# EAGLE design Simple WiFi RS232 by Bruno (EAGLE 9.6.1)
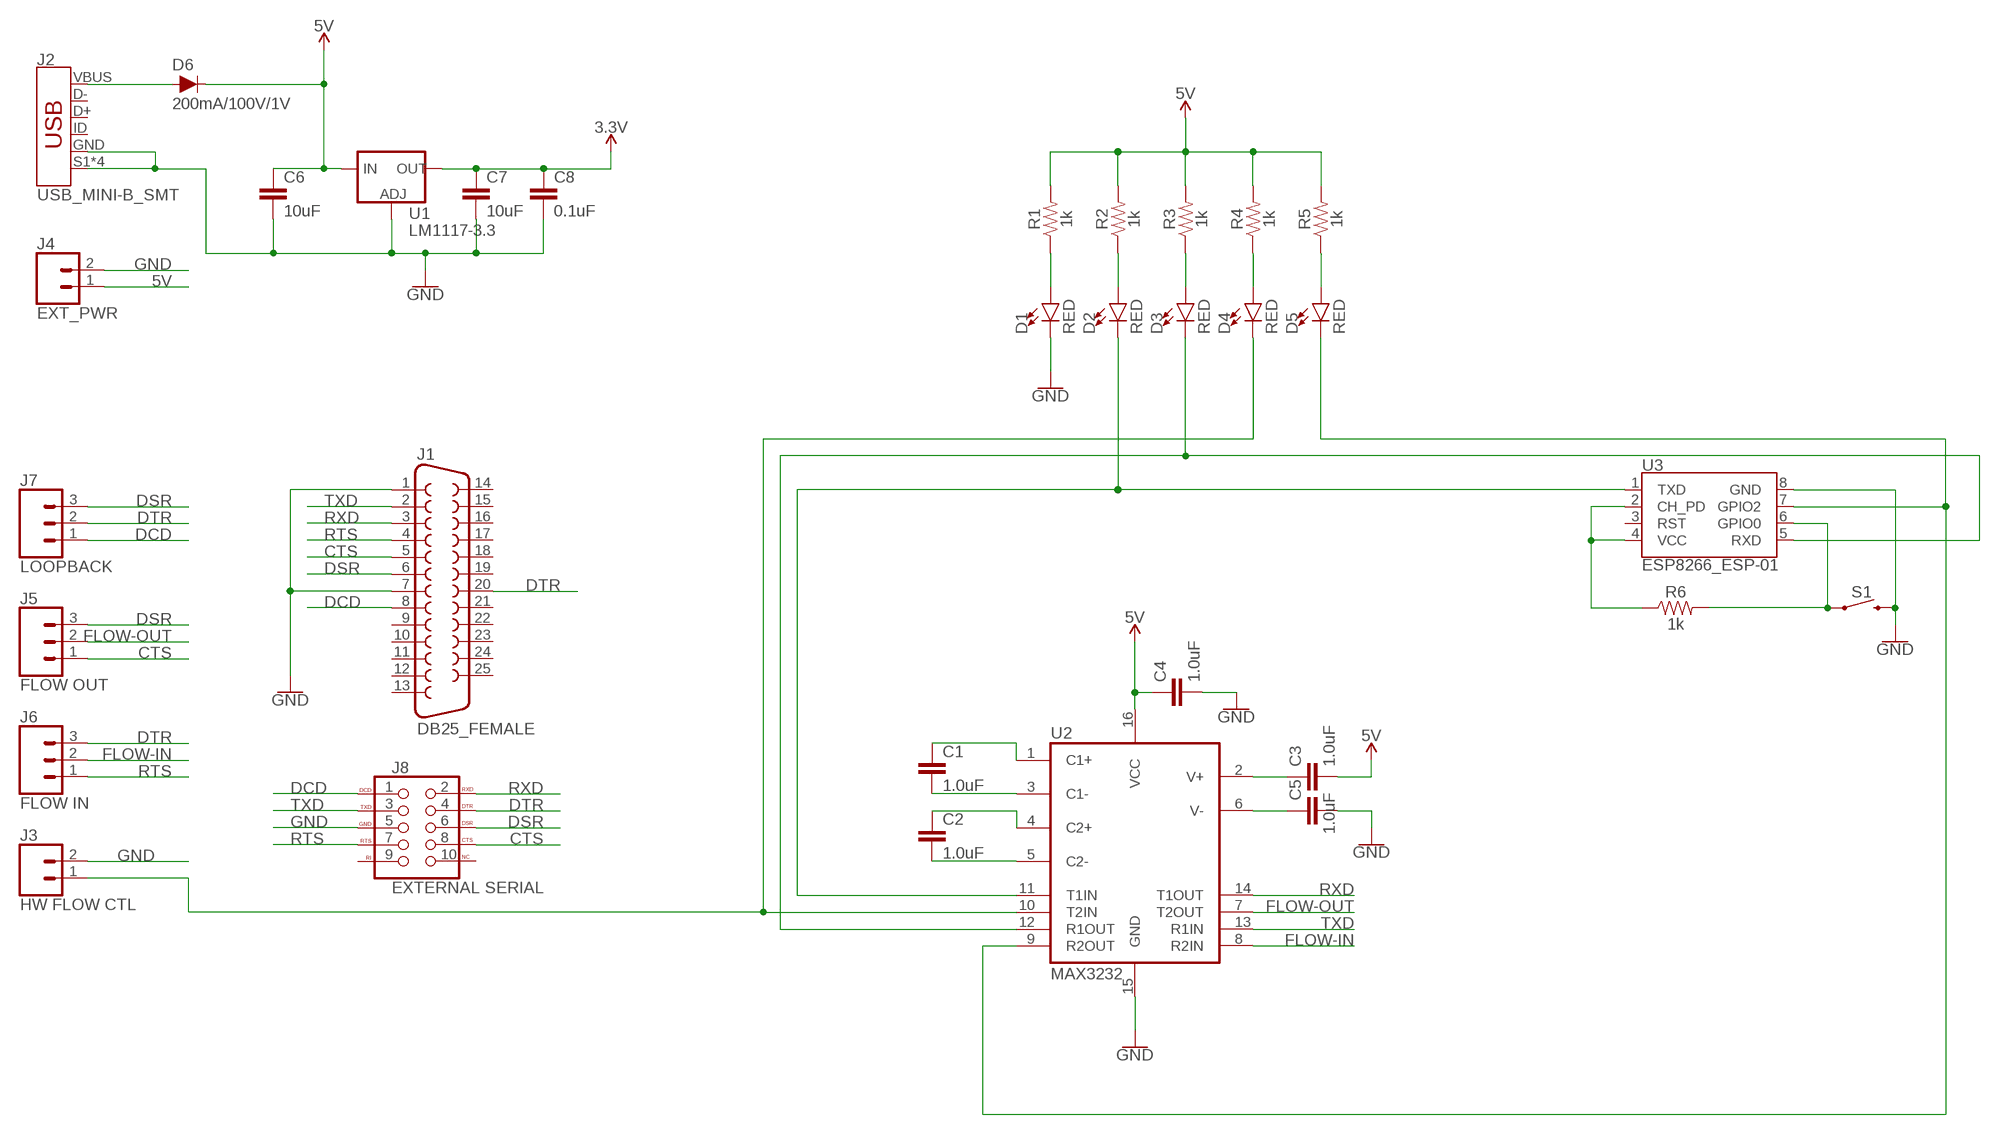
[diagram p0: schematic, sheet 1]

## Parts
C1  1.0uF  1.0UF-0603-16V-10%  [0603]
C2  1.0uF  1.0UF-0603-16V-10%  [0603]
C3  1.0uF  1.0UF-0603-16V-10%  [0603]
C4  1.0uF  1.0UF-0603-16V-10%  [0603]
C5  1.0uF  1.0UF-0603-16V-10%  [0603]
C6  10uF  10UF-0603-6.3V-20%  [0603]
C7  10uF  10UF-0603-6.3V-20%  [0603]
C8  0.1uF  0.1UF-0603-25V-(+80/-20%)  [0603]
D1  RED  LED-RED0603  [LED-0603]
D2  RED  LED-RED0603  [LED-0603]
D3  RED  LED-RED0603  [LED-0603]
D4  RED  LED-RED0603  [LED-0603]
D5  RED  LED-RED0603  [LED-0603]
D6  200mA/100V/1V  DIODE-1N4148  [DIODE-1N4148]
J1  DB25_FEMALE  DB25_FEMALEHP  [F25HP]
J2  USB_MINI-B_SMT  [USB-MINIB]
J3  HW FLOW CTL  CONN_02  [1X02]
J4  EXT_PWR  CONN_02  [1X02]
J5  FLOW OUT  CONN_03  [1X03]
J6  FLOW IN  CONN_03  [1X03]
J7  LOOPBACK  CONN_03  [1X03]
J8  EXTERNAL SERIAL  10PIN_SERIALPTH2  [2X5-SHROUDED]
R1  1k  1KOHM-0603-1/10W-1%  [0603]
R2  1k  1KOHM-0603-1/10W-1%  [0603]
R3  1k  1KOHM-0603-1/10W-1%  [0603]
R4  1k  1KOHM-0603-1/10W-1%  [0603]
R5  1k  1KOHM-0603-1/10W-1%  [0603]
R6  1k  1KOHM-0603-1/10W-1%  [0603]
S1  MOMENTARY-SWITCH-SPST-PTH-6.0MM  [TACTILE_SWITCH_PTH_6.0MM]
U1  LM1117-3.3  V_REG_LM1117SOT223  [SOT223]
U2  MAX3232  MAX2323PTH  [DIP16]
U3  ESP8266_ESP-01  [ESP8266_ESP-01]

## Nets
3.3V: C7.1 C8.1 U1.2(OUT) U1.4(OUT)
5V: C3.2 C4.1 C6.1 D6.C J4.1 R1.2 R2.2 R3.2 R4.2 R5.2 U1.3(IN) U2.16(VCC)
CTS: J1.5 J5.1 J8.8(CTS)
DCD: J1.8 J7.1 J8.1(DCD)
DSR: J1.6 J5.3 J7.3 J8.6(DSR)
DTR: J1.20 J6.3 J7.2 J8.4(DTR)
FLOW-IN: J6.2 U2.8(R2IN)
FLOW-OUT: J5.2 U2.7(T2OUT)
GND: C4.2 C5.2 C6.2 C7.2 C8.2 D1.C J1.1 J1.7 J2.GND J2.S1(SHIELD) J2.S2(SHIELD) J2.S3(SHIELD) J2.S4(SHIELD) J3.2 J4.2 J8.5(GND) S1.3 U1.1(ADJ) U2.15(GND) U3.8(GND)
N$1: R6.2 S1.1 U3.6(GPIO0)
N$2: C1.1 U2.1(C1+)
N$3: C1.2 U2.3(C1-)
N$4: C2.1 U2.4(C2+)
N$5: C2.2 U2.5(C2-)
N$6: C3.1 U2.2(V+)
N$7: C5.1 U2.6(V-)
N$8: D1.A R1.1
N$9: D2.A R2.1
N$10: D3.A R3.1
N$11: D4.A R4.1
N$12: D5.A R5.1
N$13: R6.1 U3.2(CH_PD) U3.4(VCC)
N$14: D6.A J2.VBUS
N$15: D4.C J3.1 U2.10(T2IN)
N$16: D2.C U2.11(T1IN) U3.1(TXD)
N$17: D3.C U2.12(R1OUT) U3.5(RXD)
N$18: D5.C U2.9(R2OUT) U3.7(GPIO2)
RTS: J1.4 J6.1 J8.7(RTS)
RXD: J1.3 J8.2(RXD) U2.14(T1OUT)
TXD: J1.2 J8.3(TXD) U2.13(R1IN)
Unconnected: J1.9 J1.10 J1.11 J1.12 J1.13 J1.14 J1.15 J1.16 J1.17 J1.18 J1.19 J1.21 J1.22 J1.23 J1.24 J1.25 J2.D+ J2.D- J2.ID J8.9(RI) U3.3(RST)

## Power pins joined to a net without a drawn wire
NC: J8.10(NC)

## Library data of the parts
C1-C5 = SparkFun-Capacitors:1.0UF: 1µF ceramic capacitors A capacitor is a passive two-terminal electrical component used to store electrical energy temporarily in an electric field.; PROD_ID: CAP-00868
C6 C7 = SparkFun-Capacitors:10UF: 10.0µF ceramic capacitors A capacitor is a passive two-terminal electrical component used to store electrical energy temporarily in an electric field.; PROD_ID: CAP-11015
C8 = SparkFun-Capacitors:0.1UF: 0.1µF ceramic capacitors A capacitor is a passive two-terminal electrical component used to store electrical energy temporarily in an electric field.; PROD_ID: CAP-00810
D1-D5 = SparkFun-LED:LED-RED: Red SMD LED Used in manufacturing of most products at SparkFun Packages: 0603 - SMD 0603 package [Product Link] <http://docs.avagotech.com/docs/AV02-0551EN> 0603 SMART - SMD 0603 SMART package ( more efficient and expensive)[Product Link] <http://www.osram-os.com/Graphics/XPic2/00077099_0.pdf> 1206 - SMD1206 package [Product Link] <https://www.sparkfun.com/datasheets/DevTools/LilyPad/Q150OVS4.pdff> SparkFun Products: Pro Mini 328 -5V <https://www.sparkfun.com/products/821> RedBoard <https://www.sparkfun.com/products/12757> IOIO-OTG <https://www.sparkfun.com/products/13613>; PROD_ID: DIO-00819
D6 = SparkFun-DiscreteSemi:DIODE: Diode These are standard reverse protection diodes and small signal diodes. SparkFun Products: SparkFun SparkPunk Sound Kit <https://www.sparkfun.com/products/11177> SparkFun ESP8266 Thing <https://www.sparkfun.com/products/13231>; PROD_ID: DIO-08378
J1 = SparkFun-Retired:DB25_FEMALE: 25 Pin male connector. PCB edge mount for regular PCB thicknesses. This connector will connect directly to the back of a PC parallel port or through a normal DB25 extension cable (M/F). SKU: PRT-08287
J2 = SparkFun-Connectors:USB_MINI-B: USB type Mini-B Connector Breaks out 5th pin, and includes shield pins if needed. SparkFun Products: SparkFun FTDI Basic Breakout <https://www.sparkfun.com/products/9716> SparkFun XBee Explorer USB <https://www.sparkfun.com/products/11812> SparkFun Redboard <https://www.sparkfun.com/products/12757>; PROD_ID: CONN-08193; SF_ID: PRT-00587
J3 J4 = SparkFun-Connectors:CONN_02: Multi connection point. Often used as Generic Header-pin footprint for 0.1 inch spaced/style header connections On any of the 0.1 inch spaced packages, you can populate with these: Break Away Headers - Straight <https://www.sparkfun.com/products/116> (PRT-00116) Break Away Male Headers - Right Angle <https://www.sparkfun.com/products/553> (PRT-00553) Female Headers <https://www.sparkfun.com/products/115> (PRT-00115) Break Away Headers - Machine Pin <https://www.sparkfun.com/products/117> (PRT-00117) Break Away Female Headers - Swiss Machine Pin <https://www.sparkfun.com/products/743> (PRT-00743) For SCREWTERMINALS and SPRING TERMINALS visit here: Screw Terimnals on SparkFun.com <https://www.sparkfun.com/search/results?term=Screw+Terminals> (5mm/3.5mm/2.54mm spacing) This device is also useful as a general connection point to wire up your design to another part of your project. Our various solder wires solder well into these plated through hole pads. Hook-Up Wire - Assortment (Stranded, 22 AWG) <https://www.sparkfun.com/products/11375> (PRT-11375) Hook-Up Wire - Assortment (Solid Core, 22 AWG) <https://www.sparkfun.com/products/11367> (PRT-11367) View the entire wire category on our website here <https://www.sparkfun.com/categories/141> Special notes: Molex polarized connector foot print use with: PRT-08233 with associated crimp pins and housings. 2.54_SCREWTERM for use with PRT-10571. 3.5mm Screw Terminal footprints for PRT-08084 5mm Screw Terminal footprints for use with PRT-08432
J5-J7 = SparkFun-Connectors:CONN_03: Multi connection point. Often used as Generic Header-pin footprint for 0.1 inch spaced/style header connections On any of the 0.1 inch spaced packages, you can populate with these: Break Away Headers - Straight <https://www.sparkfun.com/products/116> (PRT-00116) Break Away Male Headers - Right Angle <https://www.sparkfun.com/products/553> (PRT-00553) Female Headers <https://www.sparkfun.com/products/115> (PRT-00115) Break Away Headers - Machine Pin <https://www.sparkfun.com/products/117> (PRT-00117) Break Away Female Headers - Swiss Machine Pin <https://www.sparkfun.com/products/743> (PRT-00743) Stackable Header - 3 Pin (Female, 0.1") <https://www.sparkfun.com/products/13875> (PRT-13875) For SCREWTERMINALS and SPRING TERMINALS visit here: Screw Terimnals on SparkFun.com <https://www.sparkfun.com/search/results?term=Screw+Terminals> (5mm/3.5mm/2.54mm spacing) This device is also useful as a general connection point to wire up your design to another part of your project. Our various solder wires solder well into these plated through hole pads. Hook-Up Wire - Assortment (Stranded, 22 AWG) <https://www.sparkfun.com/products/11375> (PRT-11375) Hook-Up Wire - Assortment (Solid Core, 22 AWG) <https://www.sparkfun.com/products/11367> (PRT-11367) View the entire wire category on our website here <https://www.sparkfun.com/categories/141> Special notes: Molex polarized connector foot print use with SKU : PRT-08232 with associated crimp pins and housings.
J8 = myparts:10PIN_SERIAL: AVR 10-pin ICSP Header This is the standard AVR In Circuit Serial Programming header. Minimal, but includes pin one indicator. Works with standard Olimex programmers. This part has been reconfigured to the pinout for a standard 10-pin RS-232 header SparkFun Products: 2x5 AVR ICSP Male Header <https://www.sparkfun.com/products/778> - PTH 2x5 Pin Shrouded Header <https://www.sparkfun.com/products/8506> - PTH2; PROD_ID: CONN-08671; SF_ID: PRT-08506
R1-R6 = SparkFun-Resistors:1KOHM: 1kΩ resistor A resistor is a passive two-terminal electrical component that implements electrical resistance as a circuit element. Resistors act to reduce current flow, and, at the same time, act to lower voltage levels within circuits. - Wikipedia; PROD_ID: RES-07856
S1 = SparkFun-Switches:MOMENTARY-SWITCH-SPST: Momentary Switch (Pushbutton) - SPST Normally-open (NO) SPST momentary switches (buttons, pushbuttons). Variants PTH-12MM - 12mm square, through-hole Momentary Pushbutton Switch - 12mm Square <https://www.sparkfun.com/products/9190> (COM-09190) PTH-6.0MM, PTH-6.0MM-KIT - 6.0mm square, through-hole Mini Pushbutton Switch <https://www.sparkfun.com/products/97> (COM-00097) KIT package intended for soldering kit's - only one side of pads' copper is exposed. PTH-RIGHT-ANGLE-KIT - Right-angle, through-hole Right Angle Tactile Button <https://www.sparkfun.com/products/10791> - Used on SparkFun BigTime Watch Kit <https://www.sparkfun.com/products/11734> SMD-12MM - 12mm square, surface-mount Tactile Button - SMD (12mm) <https://www.sparkfun.com/products/12993> (COM-12993) Used on SparkFun PicoBoard <https://www.sparkfun.com/products/11888> SMD-4.5MM - 4.5mm Square Trackball Switch Used on SparkFun Blackberry Trackballer Breakout <https://www.sparkfun.com/products/13169> SMD-4.6MMX2.8MM - 4.60mm x 2.80mm, surface mount Used on SparkFun SAMD21 Mini Breakout <https://www.sparkfun.com/products/13664> SMD-5.2MM, SMD-5.2-REDUNDANT - 5.2mm square, surface-mount Mini Pushbutton Switch - SMD <https://www.sparkfun.com/products/8720> (COM-08720) Used on Arduino Pro Mini <https://www.sparkfun.com/products/11114> REDUNDANT package connects both switch circuits together SMD-6.0X3.5MM - 6.0 x 3.5mm, surface mount Momentary Reset Switch SMD <https://www.sparkfun.com/products/8229> (COM-08229) SMD-6.2MM-TALL - 6.2mm square, surface mount Tactile Button - SMD (6mm) <https://www.sparkfun.com/products/12992> Used on SparkFun Digital Sandbox <https://www.sparkfun.com/products/12651> SMD-RIGHT-ANGLE - Right-angle, surface mount Used on SparkFun Block for Intel® Edison - Arduino <https://www.sparkfun.com/products/13036>; PROD_ID: SWCH-08441; SF_SKU: COM-00097
U1 = SparkFun-IC-Power:V_REG_LM1117: Voltage Regulator LM1117 Standard adjustable voltage regulator but in SMD form. Spark Fun Electronics SKU : COM-00595; PROD_ID: VREG-08170
U2 = SparkFun-IC-Comms:MAX2323: RS232 Transceiver This part covers 232 drivers that are compatible with the MAX3232. Sipex SP3232EB Datasheet <http://cdn.sparkfun.com/datasheets/Components/General%20IC/SP3232EBCA-L.pdf> SparkFun Products SOIC component <https://www.sparkfun.com/products/589> (COM-00589 / IC-08171) Retired DIP component (COM-00316 / IC-08446) SparkFun Transceiver Breakout - MAX3232 <https://www.sparkfun.com/products/11189> (BOB-11189) SparkFun XBee Explorer Serial <https://www.sparkfun.com/products/13225> (WRL-13225); PROD_ID: IC-08446
U3 = SparkFun-RF:ESP8266_ESP-01: ESP8266 ESP-01 Module The ESP8266 WiFi Module is a self contained SOC with integrated TCP/IP protocol stack that can give any microcontroller access to your WiFi network. The ESP8266 is capable of either hosting an application or offloading all Wi-Fi networking functions from another application processor. Each ESP8266 module comes pre-programmed with an AT command set firmware, meaning, you can simply hook this up to your Arduino device and get about as much WiFi-ability as a WiFi Shield offers (and that’s just out of the box)! The ESP8266 module is an extremely cost effective board with a huge, and ever growing, community. This module has a powerful enough on-board processing and storage capability that allows it to be integrated with the sensors and other application specific devices through its GPIOs with minimal development up-front and minimal loading during runtime. Its high degree of on-chip integration allows for minimal external circuitry, including the front-end module, is designed to occupy minimal PCB area. The ESP8266 supports APSD for VoIP applications and Bluetooth co-existance interfaces, it contains a self-calibrated RF allowing it to work under all operating conditions, and requires no external RF parts. SparkFun Product Page <https://www.sparkfun.com/products/13678>; SF_ID: WRL-13678

## Board
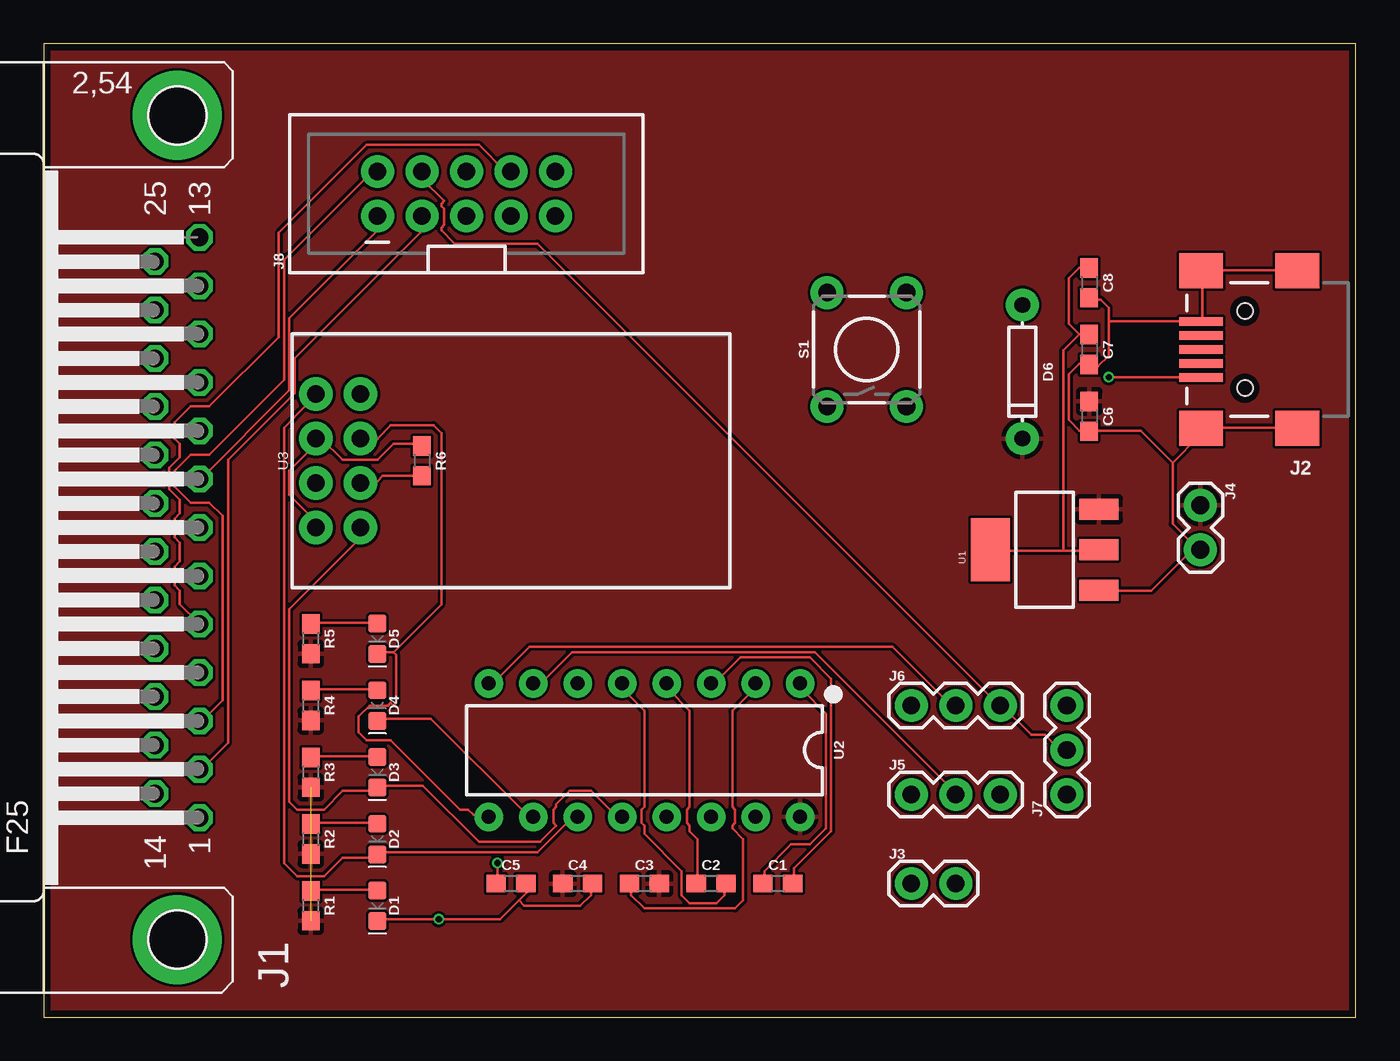
[diagram p1: board, top side]
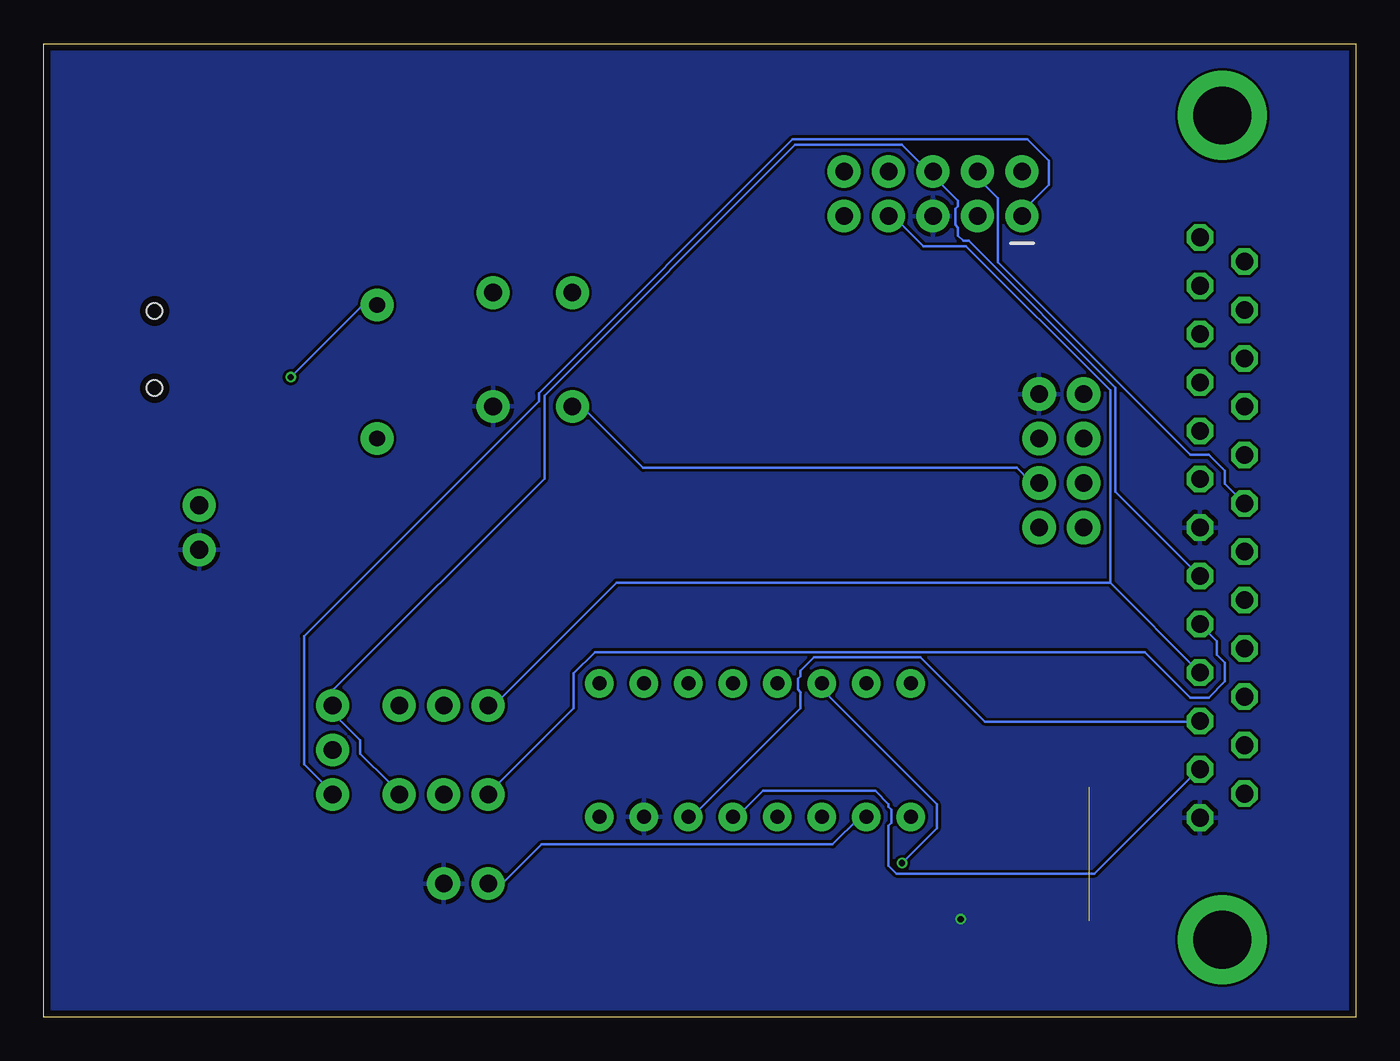
[diagram p2: board, bottom side, seen from below]

Size 74.91 x 55.55 mm. Coordinates in mm from the lower left corner, seen from the top.
Outline: 0,0 74.91,0 74.91,55.55 0,55.55 0,0
Copper layers (1*16): Top 0.035559375mm / dielectric 1.6mm / Bottom 0.035559375mm
Design rules "oshpark-2layer": minimum track width 6mil, minimum drill 10mil, track to track 6mil, track to pad 6mil, pad to pad 6mil, via to via 6mil, smd to smd 6mil, copper to edge 15mil, drill to drill 6mil, minimum pad ring 5mil, minimum via ring 5mil, stop-mask expansion 2.5mil, vias tented up to drill 0mil, thermal gap 10mil

### Footprints (pad centres in the part's own frame; a part is rotated, then mirrored left to right if it is on the bottom)
0603 = smd 1.1 x 1: 1 -0.85,0; 2 0.85,0
LED-0603 = smd 1 x 1: A -0.877,0; C 0.877,0
DIODE-1N4148 = drill 0.9 pad 1.88: A -3.81,0; C 3.81,0
F25HP = drill 1.016 octagon: 1 -16.561,-1.27; 2 -13.792,-1.27; 3 -11.049,-1.27; 4 -8.28,-1.27; 5 -5.512,-1.27; 6 -2.769,-1.27; 7 0,-1.27; 8 2.769,-1.27; 9 5.512,-1.27; 10 8.28,-1.27; 11 11.049,-1.27; 12 13.792,-1.27; 13 16.561,-1.27; 14 -15.189,1.27; 15 -12.421,1.27; 16 -9.652,1.27; 17 -6.909,1.27; 18 -4.14,1.27; 19 -1.372,1.27; 20 1.372,1.27; 21 4.14,1.27; 22 6.909,1.27; 23 9.652,1.27; 24 12.421,1.27; 25 15.189,1.27 | drill 3.302 pad 5.08: G1 -23.52,0; G2 23.52,0
USB-MINIB = smd 2.5 x 0.5: D+ 2.5,0; D- 2.5,0.8; GND 2.5,-1.6; ID 2.5,-0.8; VBUS 2.5,1.6 | smd 2.5 x 2: S1 -3,4.5; S2 2.5,4.5; S3 -3,-4.5; S4 2.5,-4.5 | hole 0.9: 0,2.2; 0,-2.2
1X02 = drill 1.016 pad 1.88: 1 0,0; 2 2.54,0
1X03 = drill 1.016 pad 1.88: 1 0,0; 2 2.54,0; 3 5.08,0
2X5-SHROUDED = drill 1.016 pad 1.88: 1 -1.27,5.08; 2 1.27,5.08; 3 -1.27,2.54; 4 1.27,2.54; 5 -1.27,0; 6 1.27,0; 7 -1.27,-2.54; 8 1.27,-2.54; 9 -1.27,-5.08; 10 1.27,-5.08
TACTILE_SWITCH_PTH_6.0MM = drill 1.016 pad 1.88: 1 -3.251,2.261; 2 3.251,2.261; 3 -3.251,-2.261; 4 3.251,-2.261
SOT223 = smd 1.219 x 2.235: 1 -2.311,-3.099; 2 0,-3.099; 3 2.311,-3.099 | smd 3.6 x 2.2: 4 0,3.099
DIP16 = drill 0.813 pad 1.626: 1 -8.89,-3.81; 2 -6.35,-3.81; 3 -3.81,-3.81; 4 -1.27,-3.81; 5 1.27,-3.81; 6 3.81,-3.81; 7 6.35,-3.81; 8 8.89,-3.81; 9 8.89,3.81; 10 6.35,3.81; 11 3.81,3.81; 12 1.27,3.81; 13 -1.27,3.81; 14 -3.81,3.81; 15 -6.35,3.81; 16 -8.89,3.81
ESP8266_ESP-01 = drill 1.016 pad 1.93: 1 -3.81,-11.13; 2 -1.27,-11.13; 3 1.27,-11.13; 4 3.81,-11.13; 5 3.81,-8.59; 6 1.27,-8.59; 7 -1.27,-8.59; 8 -3.81,-8.59

### Placement (x,y rotation side)
C1  41.91,7.62 0 top
C2  38.1,7.62 0 top
C3  34.29,7.62 0 top
C4  30.48,7.62 0 top
C5  26.67,7.62 0 top
C6  59.69,34.29 270 top
C7  59.69,38.1 270 top
C8  59.69,41.91 270 top
D1  19.05,6.35 270 top
D2  19.05,10.16 270 top
D3  19.05,13.97 270 top
D4  19.05,17.78 270 top
D5  19.05,21.59 270 top
D6  55.88,36.83 270 top
J1  7.62,27.94 90 top
J2  68.58,38.1 180 top
J3  49.53,7.62 0 top
J4  66.04,29.21 270 top
J5  49.53,12.7 0 top
J6  49.53,17.78 0 top
J7  58.42,12.7 90 top
J8  24.13,46.99 90 top
R1  15.24,6.35 270 top
R2  15.24,10.16 270 top
R3  15.24,13.97 270 top
R4  15.24,17.78 270 top
R5  15.24,21.59 270 top
R6  21.59,31.75 270 top
S1  46.99,38.1 90 top
U1  57.15,26.67 90 top
U2  34.29,15.24 180 top
U3  26.67,31.75 270 top

### Tracks (layer width: path | path; a pad name or v marks a point on that pad's centre or on a via)
3.3V
  Top 0.152: 59.13,38.96 59.59,38.96 C7.1 | 59.13,38.96 58.52,39.57 58.52,42.16 59.13,42.77 59.59,42.77 C8.1 | 58.22,26.62 54.1,26.62 U1.4 | 58.22,26.62 60.2,26.62 U1.2 | 59.13,38.96 58.22,38.05 58.22,26.62
5V  (2 unrouted)
  pour Top: 0,0 74.93,0 74.93,55.88 0,55.88
CTS
  Top 0.152: J8.8 26.36,48.26 24.84,49.78 18.44,49.78 13.41,44.75 13.41,38.81 9.45,34.85 8.38,34.85 7.47,33.93 7.47,33.02 7.77,32.71 7.77,31.95 7.16,31.34 7.16,30.12 7.77,29.52 7.77,28.75 7.47,28.45 7.47,27.38 7.77,27.08 7.77,26.01 7.47,25.71 7.47,24.64 7.77,24.33 7.77,23.57 8.84,22.5 J1.5
  Bottom 0.152: J5.1 49.53,12.75 44.65,17.63 44.65,19.61 43.43,20.83 12.04,20.83 9.45,18.24 8.38,18.24 7.47,19.15 7.47,20.22 7.92,20.68 7.92,21.44 8.84,22.35 J1.5
DCD
  Top 0.152: J8.1 19.05,44.91 14.02,39.88 14.02,35.76 8.99,30.73 J1.8
  Bottom 0.152: J8.1 19.05,45.97 17.53,47.5 17.53,48.87 18.75,50.09 32.16,50.09 46.63,35.61 46.63,35.15 60.05,21.74 60.05,14.43 58.98,13.36 58.98,13.21 58.52,12.75 J7.1
DSR
  Bottom 0.152: 58.37,17.78 58.37,17.32 56.84,15.8 56.84,15.04 55.17,13.36 55.17,13.21 54.71,12.75 J5.3 | J1.6 8.99,25.25 13.72,29.97 13.72,35.92 22.1,44.3 22.4,44.3 22.71,44.6 22.71,45.06 22.86,45.21 22.86,46.13 22.71,46.28 22.71,46.58 24.08,47.95 24.08,48.26 J8.6 24.38,48.26 25.91,49.78 32,49.78 46.33,35.46 46.33,30.73 58.37,18.69 58.37,17.78 | 58.37,17.78 J7.3
DTR
  Top 0.152: J7.2 58.37,15.34 57.91,15.34 57.15,16.1 56.39,16.1 54.71,17.78 J6.3 54.56,17.78 28.19,44.14 23.47,44.14 22.71,44.91 22.71,45.06 22.86,45.21 22.86,46.13 22.71,46.28 22.71,46.43 22.86,46.58 21.64,47.8 21.64,48.26 J8.4
  Bottom 0.152: J1.20 7.47,30.43 7.47,31.19 8.38,32.11 9.45,32.11 20.42,43.08 20.42,46.74 21.49,47.8 21.49,48.26 J8.4
FLOW-IN
  Top 0.152: J6.2 51.82,17.78 48.46,21.13 27.74,21.13 25.76,19.15 25.45,19.15 U2.8
FLOW-OUT
  Top 0.152: U2.7 28.04,19.15 28.5,19.15 30.18,20.83 44.04,20.83 52.12,12.75 J5.2
GND  (via drill 0.35)
  Top 0.152: 60.81,39.73 60.81,37.74 60.2,37.13 59.74,37.13 C7.2 59.59,37.29 59.13,37.29 58.52,36.68 58.52,34.09 59.13,33.48 59.59,33.48 C6.2 59.74,33.48 62.64,33.48 64.47,31.65 | 60.81,39.73 60.81,40.49 60.35,40.95 59.74,40.95 C8.2 | J2.S3 71.48,42.62 66.14,42.62 J2.S4 66.14,42.47 66.14,39.73 J2.GND 65.99,39.73 60.81,39.73 | 27.13,6.65 27.58,7.11 27.58,7.57 C5.2 | 27.13,6.65 26.06,5.59 v22.55,5.59 19.05,5.59 D1.C | 27.13,6.65 27.43,6.35 30.63,6.35 31.24,6.96 31.24,7.57 C4.2 | 65.53,26.62 63.25,24.33 60.35,24.33 U1.1 | 65.53,26.62 65.99,26.62 J4.2 65.53,26.62 | J2.S1 71.48,33.63 66.14,33.63 J2.S2 65.99,33.48 65.99,33.17 64.47,31.65 | 65.53,26.62 65.53,27.08 64.47,28.14 64.47,31.65
  pour Bottom: 0,0 74.93,0 74.93,55.88 0,55.88
N$1
  Top 0.152: R6.2 21.49,30.89 19.36,30.89 19.05,30.58 18.14,30.58 U3.6
  Bottom 0.152: S1.1 44.2,34.85 40.69,31.34 19.36,31.34 18.59,30.58 18.14,30.58 U3.6
N$2
  Top 0.152: C1.1 41.15,7.72 41.15,8.33 42.67,9.86 43.74,9.86 44.65,10.77 44.65,17.32 43.28,18.69 43.28,19 U2.1
N$3
  Top 0.152: C1.2 42.82,7.72 42.82,8.48 44.96,10.62 44.96,19.3 43.74,20.52 39.78,20.52 38.41,19.15 38.1,19.15 U2.3
N$4
  Top 0.152: C2.1 37.34,7.72 37.34,10.16 36.88,10.62 36.88,10.92 36.73,11.07 36.73,11.84 36.88,11.99 36.88,17.48 35.66,18.69 35.66,19 U2.4
N$5
  Top 0.152: C2.2 38.86,7.57 38.86,6.96 38.41,6.5 36.88,6.5 36.42,6.96 36.42,8.33 34.29,10.46 34.29,10.92 34.14,11.07 34.14,11.84 34.29,11.99 34.29,17.48 33.07,18.69 33.07,19 U2.5
N$6
  Top 0.152: C3.1 33.53,7.57 33.53,6.96 34.29,6.2 39.47,6.2 39.93,6.65 39.93,10.16 39.32,10.77 39.32,10.92 39.47,11.07 39.47,11.84 39.32,11.99 39.32,17.48 40.54,18.69 40.54,19 U2.2
N$7  (via drill 0.35)
  Top 0.152: v25.91,8.79 25.91,7.72 C5.1
  Bottom 0.152: v25.91,8.79 23.93,10.77 23.93,12.14 30.48,18.69 U2.6
N$8
  Top 0.152: D1.A 19.05,7.26 15.24,7.26 R1.1
N$9
  Top 0.152: D2.A 19.05,11.07 15.24,11.07 R2.1
N$10
  Top 0.152: D3.A 19.05,14.88 15.24,14.88 R3.1
N$11
  Top 0.152: D4.A 19.05,18.69 15.24,18.69 R4.1
N$12
  Top 0.152: D5.A 19.05,22.5 15.24,22.5 R5.1
N$13
  Top 0.152: R6.1 21.49,32.71 19.96,32.71 19.05,31.8 17.07,31.8 15.85,33.02 U3.2 15.39,33.02 15.39,32.56 14.02,31.19 14.02,29.82 15.39,28.45 15.39,27.99 U3.4
N$14  (via drill 0.35)
  Top 0.152: v60.81,36.52 65.99,36.52 J2.VBUS
  Bottom 0.152: v60.81,36.52 56.69,40.64 D6.A
N$15
  Top 0.152: D4.C 19.05,17.02 22.1,17.02 27.58,11.53 27.89,11.53 U2.10
  Bottom 0.152: J3.1 49.53,7.72 48.62,7.72 46.48,9.86 29.87,9.86 28.35,11.38 28.04,11.38 U2.10
N$16
  Top 0.152: U2.11 30.48,11.38 30.18,11.38 28.19,9.4 19.05,9.4 D2.C 19.05,9.25 18.9,9.09 17.07,9.09 16,8.03 14.48,8.03 13.72,8.79 13.72,33.63 14.94,34.85 14.94,35 15.39,35.46 U3.1
N$17
  Top 0.152: U2.12 32.92,11.53 32.61,11.53 31.24,12.9 30.02,12.9 29.26,12.14 29.26,11.99 29.11,11.84 29.11,11.07 29.26,10.92 28.35,10.01 24.84,10.01 21.64,13.21 19.05,13.21 D3.C 19.05,13.06 18.9,12.9 17.07,12.9 16,11.84 14.48,11.84 14.02,12.29 14.02,23.27 17.98,27.23 17.98,27.84 U3.5
N$18
  Top 0.152: 19.96,20.83 19.05,20.83 D5.C | 19.96,20.83 22.71,23.57 22.71,33.32 22.25,33.78 19.81,33.78 19.05,33.02 U3.7 | 19.96,20.83 20.12,20.68 20.12,17.93 19.96,17.78 19.81,17.93 19.66,17.78 18.59,17.78 17.98,17.17 17.98,16.26 18.44,15.8 19.81,15.8 23.77,11.84 24.23,11.84 24.54,11.53 25.3,11.53 U2.9
RTS
  Bottom 0.152: 14.02,24.79 J1.4 | 14.02,24.79 14.02,35.76 22.25,43.99 24.69,43.99 26.36,45.67 26.67,45.67 J8.7 | J6.1 49.23,17.78 42.22,24.79 14.02,24.79
RXD
  Top 0.152: J8.2 18.75,48.26 13.72,43.23 13.72,36.37 9.45,32.11 8.38,32.11 7.47,31.19 7.47,30.28 8.38,29.36 9.45,29.36 10.21,28.6 10.21,18.09 8.99,16.87 J1.3
  Bottom 0.152: J1.3 8.99,16.87 21.18,16.87 24.84,20.52 30.94,20.52 31.7,19.76 31.7,19.46 31.85,19.3 31.85,18.69 31.7,18.54 31.7,17.63 37.8,11.53 38.1,11.53 U2.14
TXD
  Top 0.152: J8.3 21.49,45.67 21.49,44.75 14.33,37.59 14.33,35.61 10.52,31.8 10.52,15.65 8.99,14.12 J1.2
  Bottom 0.152: J1.2 8.99,14.12 14.94,8.18 26.21,8.18 26.67,8.64 26.67,10.92 26.52,11.07 26.52,11.84 26.67,11.99 26.67,12.14 27.43,12.9 33.83,12.9 35.2,11.53 35.51,11.53 U2.13